# EAGLE design GCC-ECS-0001.1 (EAGLE 5.10)
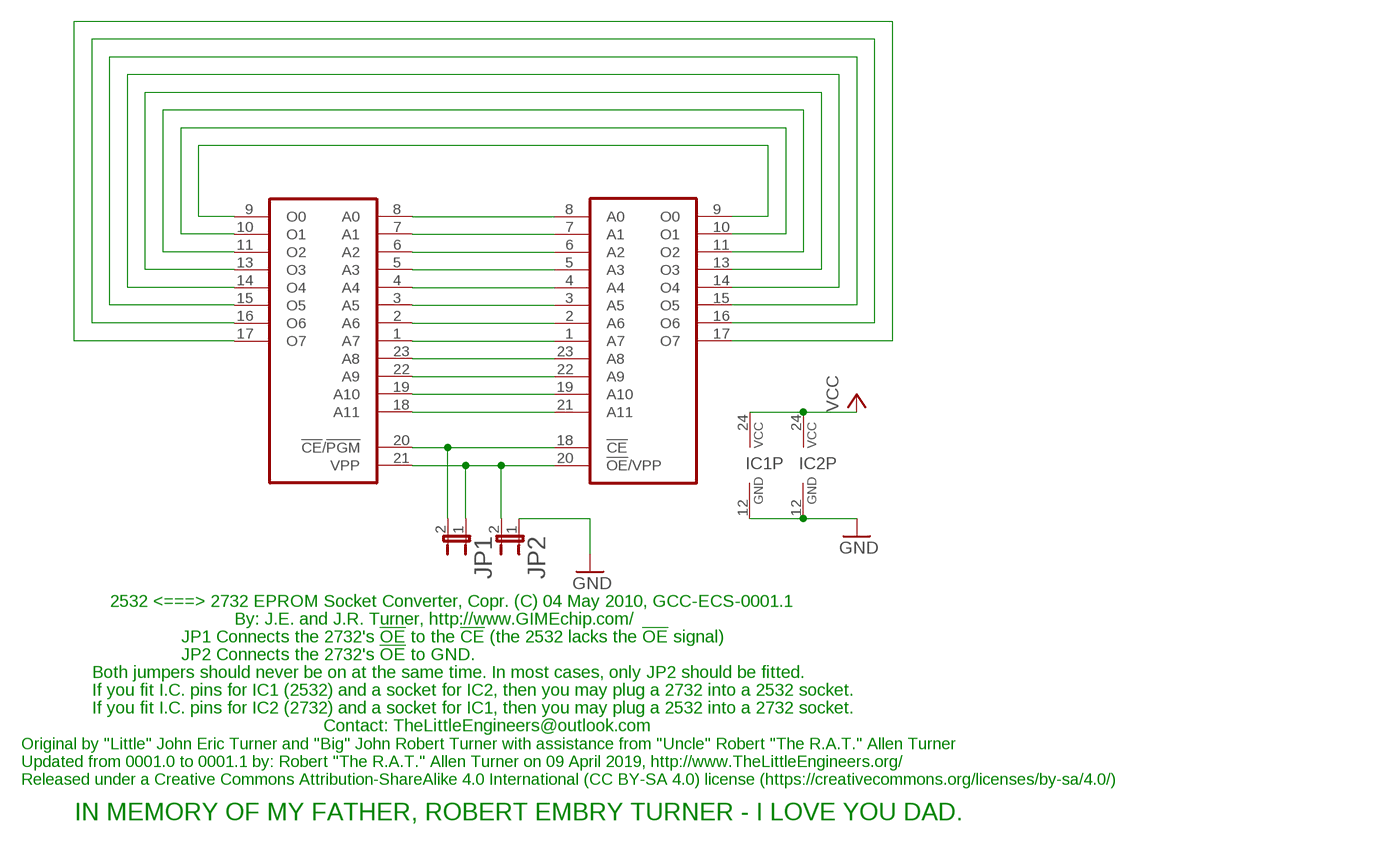
[diagram p0: schematic, sheet 1]

## Parts
IC1  2532  [DIL24]
IC2  2732  [DIL24]
JP1  JP  [JP1]
JP2  JP  [JP1]

## Nets
GND [power]: IC1.12(GND) IC2.12(GND) JP2.1
N$1: IC1.8(A0) IC2.8(A0)
N$2: IC1.7(A1) IC2.7(A1)
N$3: IC1.6(A2) IC2.6(A2)
N$4: IC1.5(A3) IC2.5(A3)
N$5: IC1.4(A4) IC2.4(A4)
N$6: IC1.3(A5) IC2.3(A5)
N$7: IC1.2(A6) IC2.2(A6)
N$8: IC1.1(A7) IC2.1(A7)
N$9: IC1.23(A8) IC2.23(A8)
N$10: IC1.22(A9) IC2.22(A9)
N$11: IC1.19(A10) IC2.19(A10)
N$12: IC1.18(A11) IC2.21(A11)
N$13: IC1.20(!CE!/!PGM) IC2.18(!CE) JP1.2
N$14: IC1.21(VPP) IC2.20(!OE!/VPP) JP1.1 JP2.2
N$15: IC1.9(O0) IC2.9(O0)
N$16: IC1.10(O1) IC2.10(O1)
N$17: IC1.11(O2) IC2.11(O2)
N$18: IC1.13(O3) IC2.13(O3)
N$19: IC1.14(O4) IC2.14(O4)
N$20: IC1.15(O5) IC2.15(O5)
N$21: IC1.16(O6) IC2.16(O6)
N$22: IC1.17(O7) IC2.17(O7)
VCC [power]: IC1.24(VCC) IC2.24(VCC)

## Notes on the sheet
- 2532 <===> 2732 EPROM Socket Converter, Copr. (C) 04 May 2010, GCC-ECS-0001.1
- By: J.E. and J.R. Turner, http://www.GIMEchip.com/
- JP1 Connects the 2732's !OE! to the !CE! (the 2532 lacks the !OE! signal)
- JP2 Connects the 2732's !OE! to GND.
- Both jumpers should never be on at the same time. In most cases, only JP2 should be fitted.
- If you fit I.C. pins for IC1 (2532) and a socket for IC2, then you may plug a 2732 into a 2532 socket.
- If you fit I.C. pins for IC2 (2732) and a socket for IC1, then you may plug a 2532 into a 2732 socket.
- Contact: TheLittleEngineers@outlook.com
- Original by "Little" John Eric Turner and "Big" John Robert Turner with assistance from "Uncle" Robert "The R.A.T." Allen Turner
- Updated from 0001.0 to 0001.1 by: Robert "The R.A.T." Allen Turner on 09 April 2019, http://www.TheLittleEngineers.org/
- Released under a Creative Commons Attribution-ShareAlike 4.0 International (CC BY-SA 4.0) license (https://creativecommons.org/licenses/by-sa/4.0/)
- IN MEMORY OF MY FATHER, ROBERT EMBRY TURNER - I LOVE YOU DAD.

## Library data of the parts
IC1 = GCC-ECS-0001.1:2532: TMS2532 EPROM GIMEChip.com TheLittleEngineers.org "Little" John Eric Turner "Big" John Robert Turner "Uncle" Robert "The R.A.T." Allen Turner Unless otherwise noted, content of this library is licensed under a Creative Commons Attribution-ShareAlike 4.0 International (CC BY-SA 4.0) license (https://creativecommons.org/licenses/by-sa/4.0/)
IC2 = GCC-ECS-0001.1:2732: TMS2732A EPROM GIMEChip.com TheLittleEngineers.org "Little" John Eric Turner "Big" John Robert Turner "Uncle" Robert "The R.A.T." Allen Turner Unless otherwise noted, content of this library is licensed under a Creative Commons Attribution-ShareAlike 4.0 International (CC BY-SA 4.0) license (https://creativecommons.org/licenses/by-sa/4.0/)
JP1 JP2 = GCC-ECS-0001.1:JP: TWO-PIN JUMPER GIMEChip.com TheLittleEngineers.org "Little" John Eric Turner "Big" John Robert Turner "Uncle" Robert "The R.A.T." Allen Turner Unless otherwise noted, content of this library is licensed under a Creative Commons Attribution-ShareAlike 4.0 International (CC BY-SA 4.0) license (https://creativecommons.org/licenses/by-sa/4.0/)

## Net classes
0 default: width 0.203 mm, clearance 0.203 mm
1 power: width 0.762 mm, clearance 0.254 mm

## Board
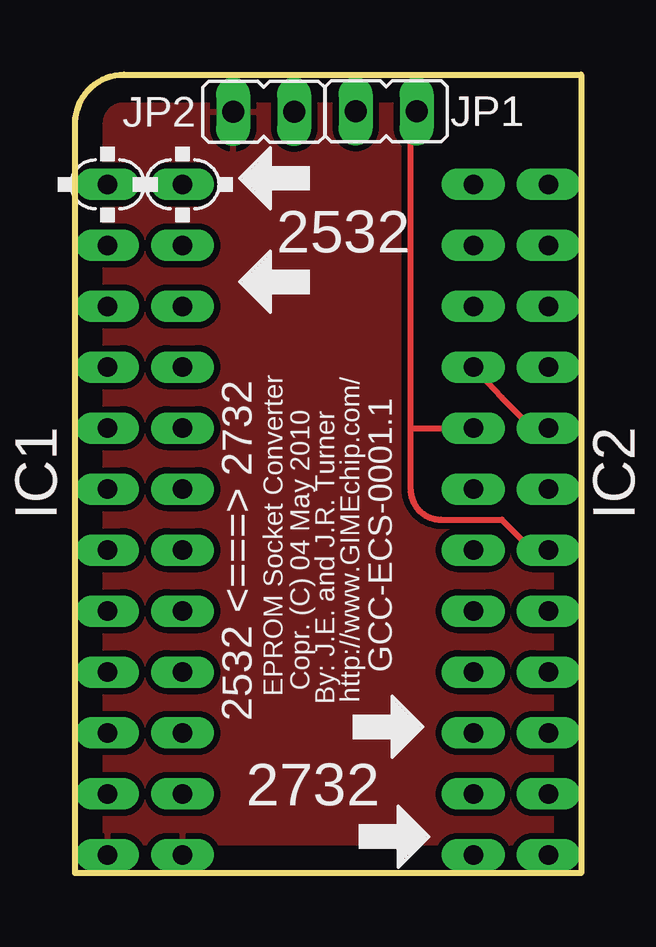
[diagram p1: board, top side]
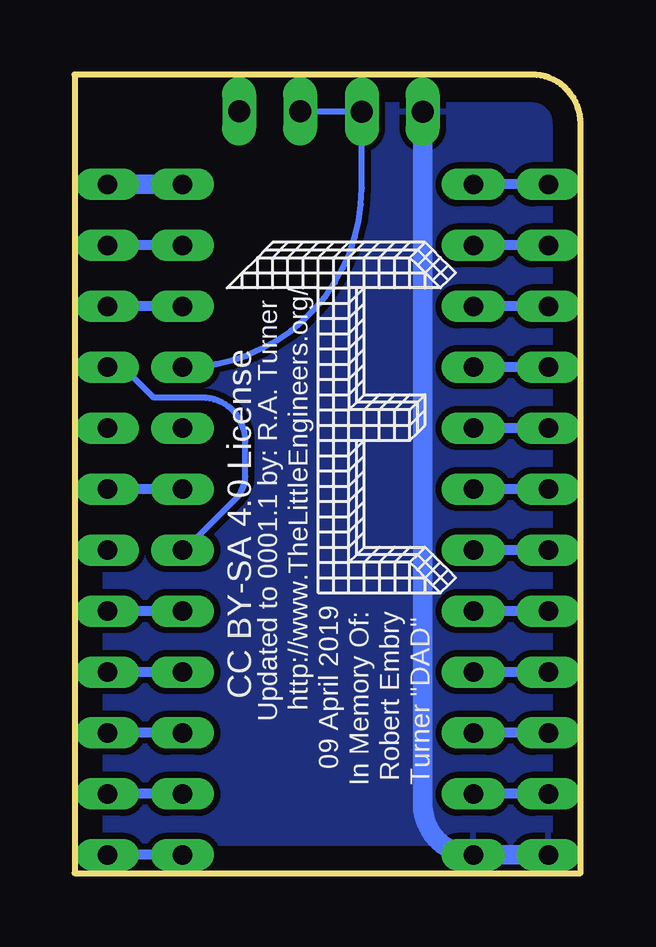
[diagram p2: board, bottom side, seen from below]

Size 21.08 x 33.27 mm. Coordinates in mm from the lower left corner, seen from the top.
Outline: 21.08,33.27 21.08,0 0,0 0,31.24 arc-90 2.03,33.27 21.08,33.27
Copper layers (1*16): Top 0.035mm / dielectric 1.5mm / Bottom 0.035mm
Design rules "default": minimum track width 10mil, minimum drill 24mil, track to track 8mil, track to pad 8mil, pad to pad 8mil, via to via 8mil, smd to smd 8mil, copper to edge 40mil, drill to drill 8mil, minimum pad ring 10mil, minimum via ring 8mil, stop-mask expansion 4mil, vias tented up to drill 0mil, thermal gap 10mil

### Footprints (pad centres in the part's own frame; a part is rotated, then mirrored left to right if it is on the bottom)
DIL24 = drill 0.813 long: 1 -13.97,-7.62; 2 -11.43,-7.62; 3 -8.89,-7.62; 4 -6.35,-7.62; 5 -3.81,-7.62; 6 -1.27,-7.62; 7 1.27,-7.62; 8 3.81,-7.62; 9 6.35,-7.62; 10 8.89,-7.62; 11 11.43,-7.62; 12 13.97,-7.62; 13 13.97,7.62; 14 11.43,7.62; 15 8.89,7.62; 16 6.35,7.62; 17 3.81,7.62; 18 1.27,7.62; 19 -1.27,7.62; 20 -3.81,7.62; 21 -6.35,7.62; 22 -8.89,7.62; 23 -11.43,7.62; 24 -13.97,7.62
JP1 = drill 0.914 long: 1 0,-1.27; 2 0,1.27

### Placement (x,y rotation side)
IC1  8.97,14.73 270 top
IC2  12.09,14.73 270 top
JP1  12.95,31.75 270 top
JP2  7.85,31.72 270 top
U$1  [ARROW-L]  8.13,28.96 0 top
U$2  [ARROW-L]  8.13,24.64 0 top
U$3  [ARROW-R]  13.46,1.52 0 top
U$4  [ARROW-R]  13.21,6.1 0 top
U$5  [TLE-LOGO]  14.73,11.68 0 bottom

### Tracks (layer width: path | path; a pad name or v marks a point on that pad's centre or on a via)
GND
  Bottom 0.813: IC1.12 IC2.12 arc90 6.58,2.87 JP2.1
  pour Bottom: 21.08,33.27 0,33.27 0,0 21.08,0
  pour Top: 21.08,33.27 0,33.27 0,0 21.08,0
N$1
  Bottom 0.406: IC1.8 IC2.8
N$2
  Bottom 0.406: IC1.7 IC2.7
N$3
  Bottom 0.406: IC1.6 IC2.6
N$4
  Bottom 0.406: IC1.5 IC2.5
N$5
  Bottom 0.406: IC1.4 IC2.4
N$6
  Bottom 0.406: IC1.3 IC2.3
N$7
  Bottom 0.406: IC1.2 IC2.2
N$8
  Bottom 0.406: IC1.1 IC2.1
N$9
  Bottom 0.406: IC1.23 IC2.23
N$10
  Bottom 0.406: IC1.22 IC2.22
N$11
  Bottom 0.406: IC1.19 IC2.19
N$12
  Bottom 0.254: IC1.18 16.51,13.46 14.34,15.63 arc-45 13.97,16.53 13.97,18.02 arc-90 15.77,19.81 17.78,19.81 19.05,21.08 IC2.21
N$13
  Top 0.254: 13.97,18.54 13.97,31.24 JP1.2 | 13.97,18.54 13.97,16 arc90 15.24,14.73 17.78,14.73 19.05,13.46 IC2.18 | 13.97,18.54 IC1.20
N$14
  Top 0.254: IC2.20 19.05,18.54 17.78,19.81 IC1.21
  Bottom 0.254: 11.66,31.72 JP2.2 9.12,28.55 arc90 IC1.21
  Bottom 0.813: 11.66,31.72 arc90 JP1.1
N$15
  Bottom 0.406: IC1.9 IC2.9
N$16
  Bottom 0.406: IC1.10 IC2.10
N$17
  Bottom 0.406: IC1.11 IC2.11
N$18
  Bottom 0.406: IC1.13 IC2.13
N$19
  Bottom 0.406: IC1.14 IC2.14
N$20
  Bottom 0.406: IC1.15 IC2.15
N$21
  Bottom 0.406: IC1.16 IC2.16
N$22
  Bottom 0.406: IC1.17 IC2.17
VCC
  Bottom 0.813: IC1.24 IC2.24

### Text on the board
bPlace: http://www.TheLittleEngineers.org/ | Updated to 0001.1 by: R.A. Turner | CC BY-SA 4.0 License | Turner "DAD" | Robert Embry | In Memory Of: | 09 April 2019
tNames: GCC-ECS-0001.1 | EPROM Socket Converter | Copr. (C) 04 May 2010 | 2532 <===> 2732 | By: J.E. and J.R. Turner | http://www.GIMEchip.com/